# EAGLE design mt15_c (EAGLE 6.6.0)

## Sheet 1 of 3
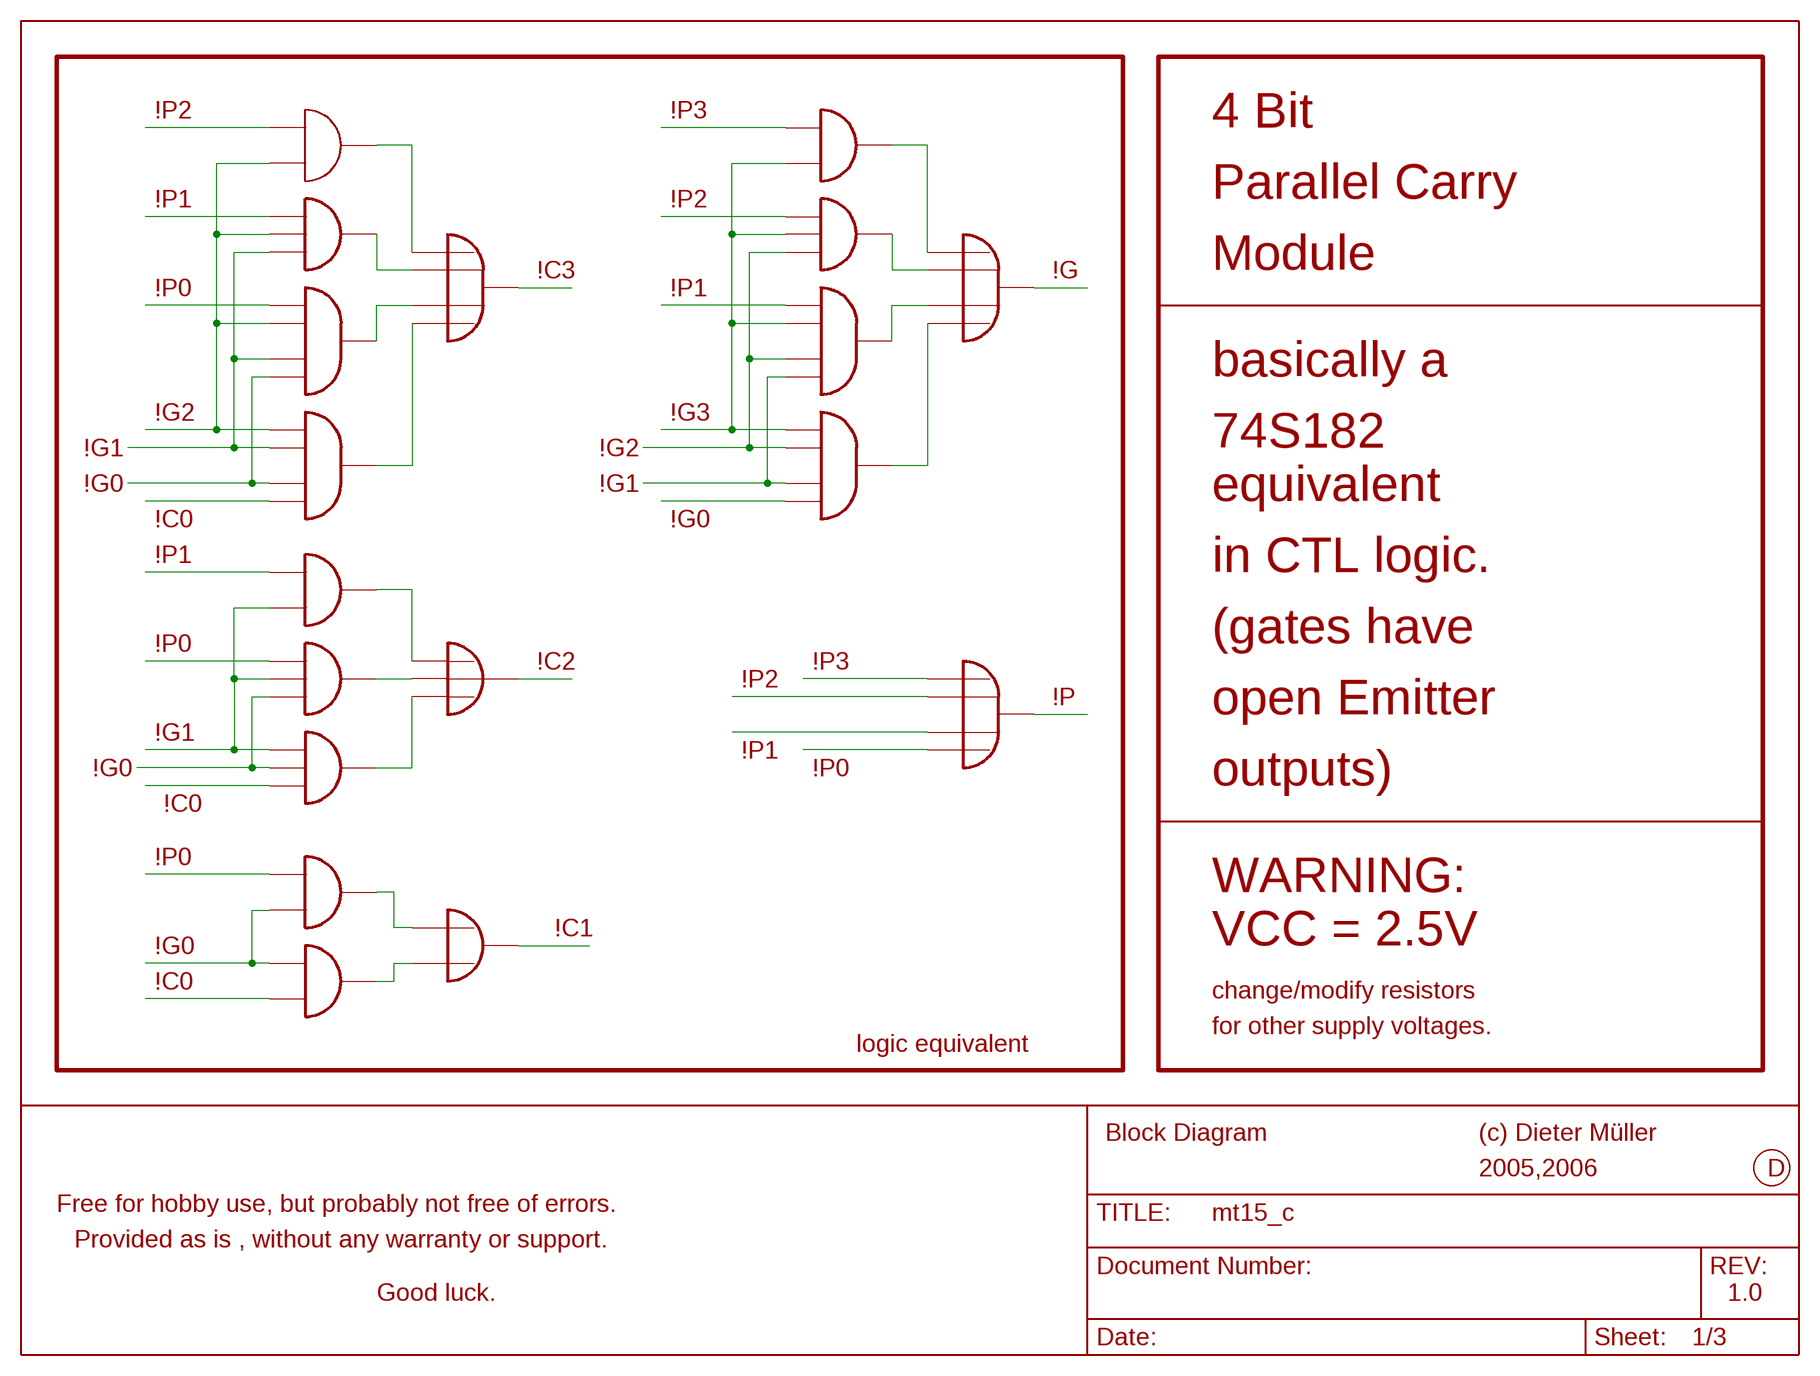
[diagram p0: schematic, sheet 1]

### Notes on the sheet
- \!P2 | \!P3
- 4 Bit
- Parallel Carry
- \!P1 | \!P2
- Module
- \!C3 | \!G
- \!P0 | \!P1
- basically a
- \!G2 | \!G3
- 74S182
- \!G1 | \!G2
- \!G0 | \!G1
- equivalent
- \!C0 | \!G0
- \!P1
- in CTL logic.
- (gates have
- \!P0
- \!C2 | \!P3
- \!P2
- \!P
- open Emitter
- \!G1
- \!P1
- \!G0 | \!P0
- outputs)
- \!C0
- \!P0
- WARNING:
- \!C1
- VCC = 2.5V
- \!G0
- \!C0
- change/modify resistors
- for other supply voltages.
- logic equivalent
- Block Diagram | (c) Dieter Müller
- 2005,2006 | D
- Free for hobby use, but probably not free of errors.
- Provided as is , without any warranty or support.
- Good luck. | 1.0
- Wenn dich jemand dann und wann,
- grundlos plötzlich lächelt an.
- Sag, was mag denn das wohl sein,
- vielleicht ein Kameradenschwein.
- Wenn sie Interesse heucheln,
- hinterrücks danach dich meucheln.
- 'Kannst du sowas nicht verzeihen',
- werden sie beleidigt schreien.
- Meine Meinung weise schlimm,
- auf Generalisierung hin.
- Nur nimmt dann, wenn ich nicht so tu',
- der Schmerz in meinem Rücken zu.
- Und trotz all der schlechten Zeit,
- bewundere ich Freundlichkeit.
- Nur ist in meinem Rücken schwer,
- kein Platz für weitere Messer mehr.
- Solltest du mich so verletzen,
- Freundlichkeit falsch einzusetzen,
- mögest du an allen Tagen,
- Meser in dem Rücken tragen.

## Sheet 2 of 3
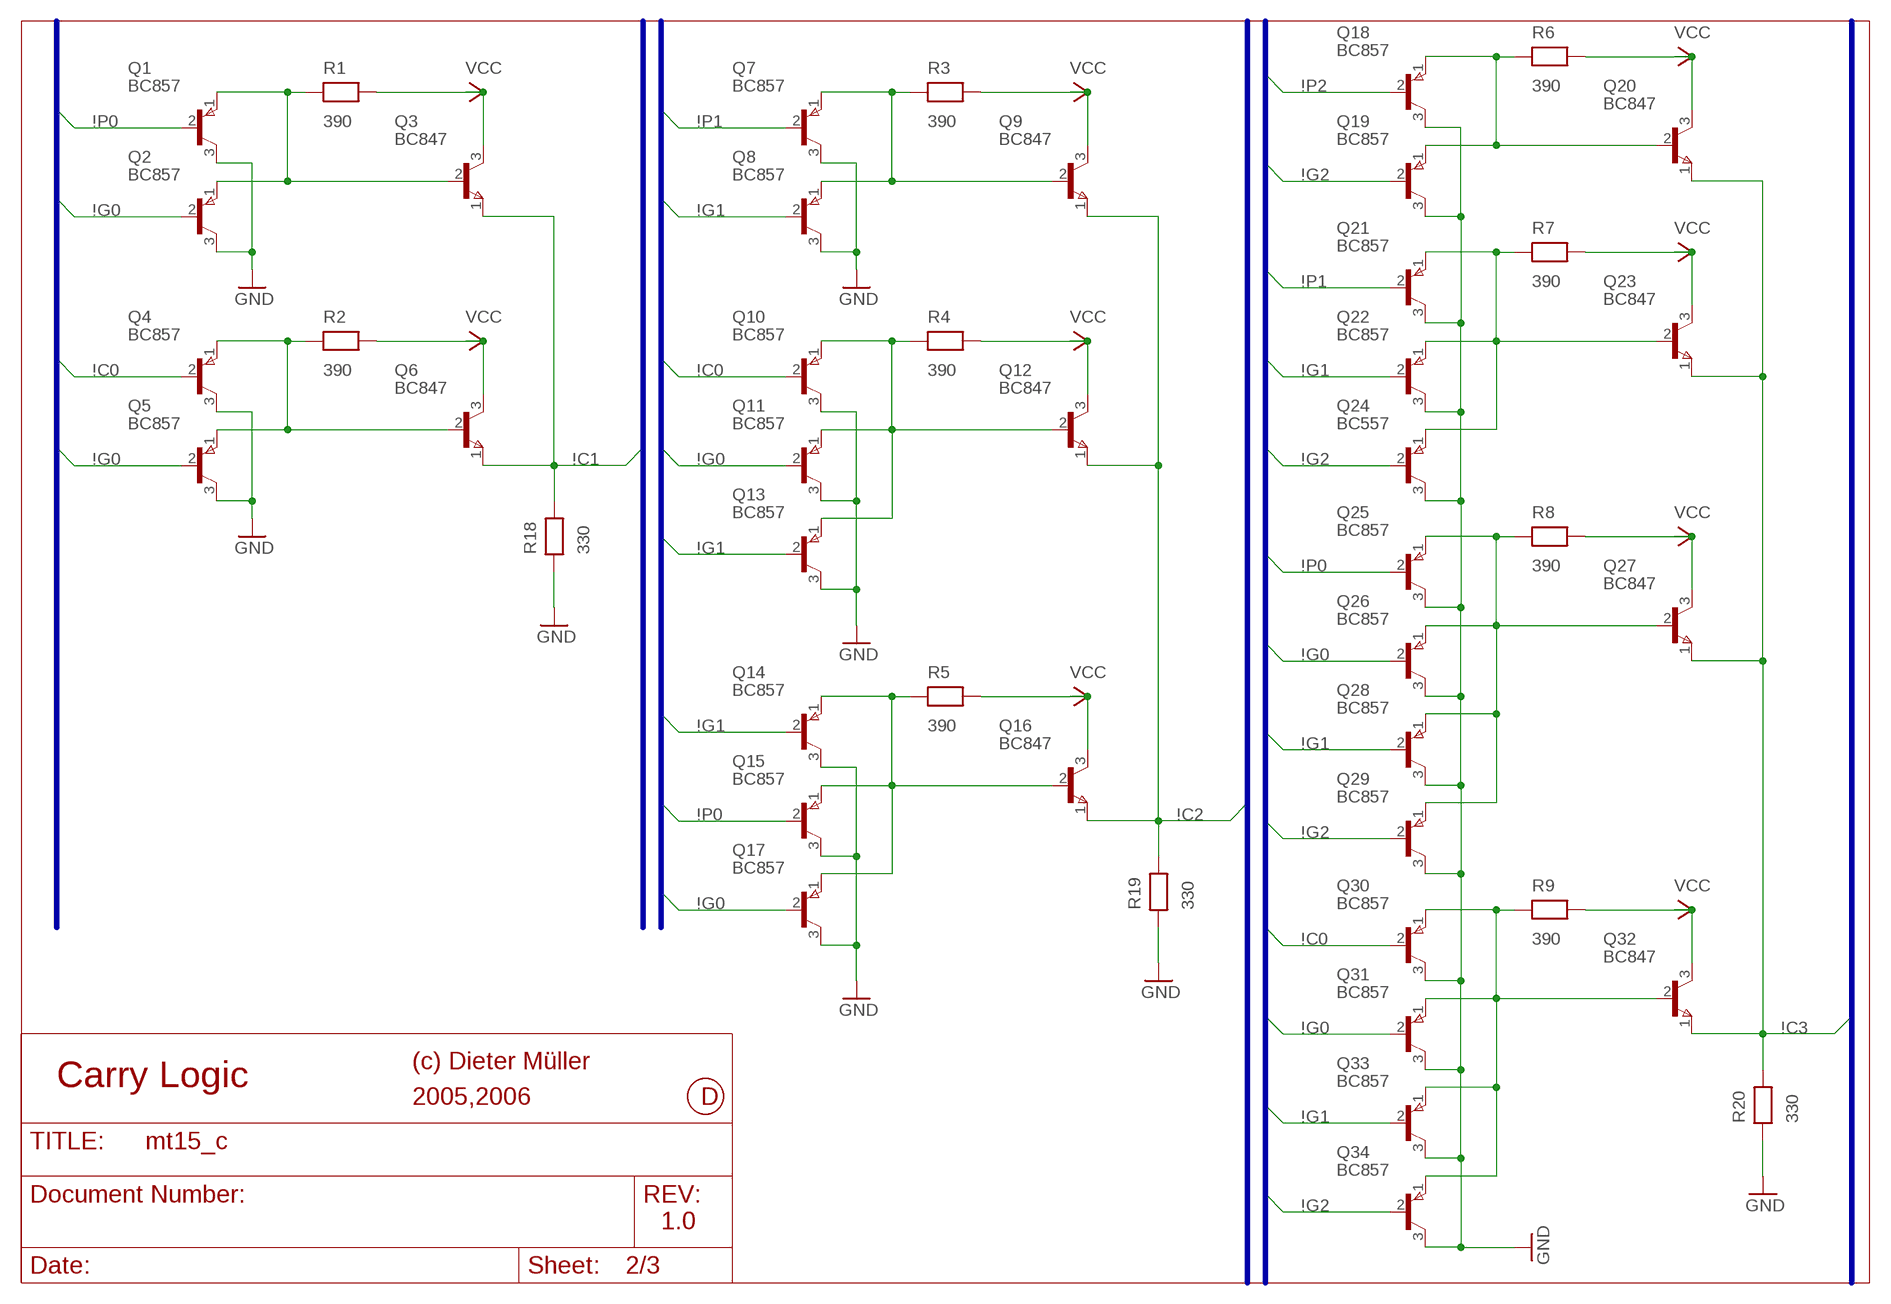
[diagram p1: schematic, sheet 2]

### Parts
Q1  BC857  BC557@2  [SOT-23]
Q2  BC857  BC557@2  [SOT-23]
Q3  BC847  BC547@2  [SOT-23]
Q4  BC857  BC557@2  [SOT-23]
Q5  BC857  BC557@2  [SOT-23]
Q6  BC847  BC547@2  [SOT-23]
Q7  BC857  BC557@2  [SOT-23]
Q8  BC857  BC557@2  [SOT-23]
Q9  BC847  BC547@2  [SOT-23]
Q10  BC857  BC557@2  [SOT-23]
Q11  BC857  BC557@2  [SOT-23]
Q12  BC847  BC547@2  [SOT-23]
Q13  BC857  BC557@2  [SOT-23]
Q14  BC857  BC557@2  [SOT-23]
Q15  BC857  BC557@2  [SOT-23]
Q16  BC847  BC547@2  [SOT-23]
Q17  BC857  BC557@2  [SOT-23]
Q18  BC857  BC557@2  [SOT-23]
Q19  BC857  BC557@2  [SOT-23]
Q20  BC847  BC547@2  [SOT-23]
Q21  BC857  BC557@2  [SOT-23]
Q22  BC857  BC557@2  [SOT-23]
Q23  BC847  BC547@2  [SOT-23]
Q24  BC557  BC557@2  [SOT-23]
Q25  BC857  BC557@2  [SOT-23]
Q26  BC857  BC557@2  [SOT-23]
Q27  BC847  BC547@2  [SOT-23]
Q28  BC857  BC557@2  [SOT-23]
Q29  BC857  BC557@2  [SOT-23]
Q30  BC857  BC557@2  [SOT-23]
Q31  BC857  BC557@2  [SOT-23]
Q32  BC847  BC547@2  [SOT-23]
Q33  BC857  BC557@2  [SOT-23]
Q34  BC857  BC557@2  [SOT-23]
R1  390  RESEU-7,5@2  [0204]
R2  390  RESEU-7,5@2  [0204]
R3  390  RESEU-7,5@2  [0204]
R4  390  RESEU-7,5@2  [0204]
R5  390  RESEU-7,5@2  [0204]
R6  390  RESEU-7,5@2  [0204]
R7  390  RESEU-7,5@2  [0204]
R8  390  RESEU-7,5@2  [0204]
R9  390  RESEU-7,5@2  [0204]
R18  330  RESEU-7,5@2  [0204]
R19  330  RESEU-7,5@2  [0204]
R20  330  RESEU-7,5@2  [0204]

### Nets
\!C0: Q4.2(B) Q10.2(B) Q30.2(B)
\!C1: Q3.1(E) Q6.1(E) R18.2
\!C2: Q9.1(E) Q12.1(E) Q16.1(E) R19.2
\!C3: Q20.1(E) Q23.1(E) Q27.1(E) Q32.1(E) R20.2
\!G0: Q2.2(B) Q5.2(B) Q11.2(B) Q17.2(B) Q26.2(B) Q31.2(B) ; also sheet 3
\!G1: Q8.2(B) Q13.2(B) Q14.2(B) Q22.2(B) Q28.2(B) Q33.2(B) ; also sheet 3
\!G2: Q19.2(B) Q24.2(B) Q29.2(B) Q34.2(B) ; also sheet 3
\!P0: Q1.2(B) Q15.2(B) Q25.2(B) ; also sheet 3
\!P1: Q7.2(B) Q21.2(B) ; also sheet 3
\!P2: Q18.2(B) ; also sheet 3
GND: Q1.3(C) Q2.3(C) Q4.3(C) Q5.3(C) Q7.3(C) Q8.3(C) Q10.3(C) Q11.3(C) Q13.3(C) Q14.3(C) Q15.3(C) Q17.3(C) Q18.3(C) Q19.3(C) Q21.3(C) Q22.3(C) Q24.3(C) Q25.3(C) Q26.3(C) Q28.3(C) Q29.3(C) Q30.3(C) Q31.3(C) Q33.3(C) Q34.3(C) R18.1 R19.1 R20.1 ; also sheet 3
N$9: Q1.1(E) Q2.1(E) Q3.2(B) R1.1
N$10: Q7.1(E) Q8.1(E) Q9.2(B) R3.1
N$11: Q4.1(E) Q5.1(E) Q6.2(B) R2.1
N$12: Q10.1(E) Q11.1(E) Q12.2(B) Q13.1(E) R4.1
N$13: Q14.1(E) Q15.1(E) Q16.2(B) Q17.1(E) R5.1
N$14: Q18.1(E) Q19.1(E) Q20.2(B) R6.1
N$15: Q21.1(E) Q22.1(E) Q23.2(B) Q24.1(E) R7.1
N$16: Q25.1(E) Q26.1(E) Q27.2(B) Q28.1(E) Q29.1(E) R8.1
N$17: Q30.1(E) Q31.1(E) Q32.2(B) Q33.1(E) Q34.1(E) R9.1
VCC: Q3.3(C) Q6.3(C) Q9.3(C) Q12.3(C) Q16.3(C) Q20.3(C) Q23.3(C) Q27.3(C) Q32.3(C) R1.2 R2.2 R3.2 R4.2 R5.2 R6.2 R7.2 R8.2 R9.2 ; also sheet 3

### Buses
B$1
B$2
B$3
B$4
B$5
B$6

### Notes on the sheet
- (c) Dieter Müller
- Carry Logic
- 2005,2006 | D
- 1.0

## Sheet 3 of 3
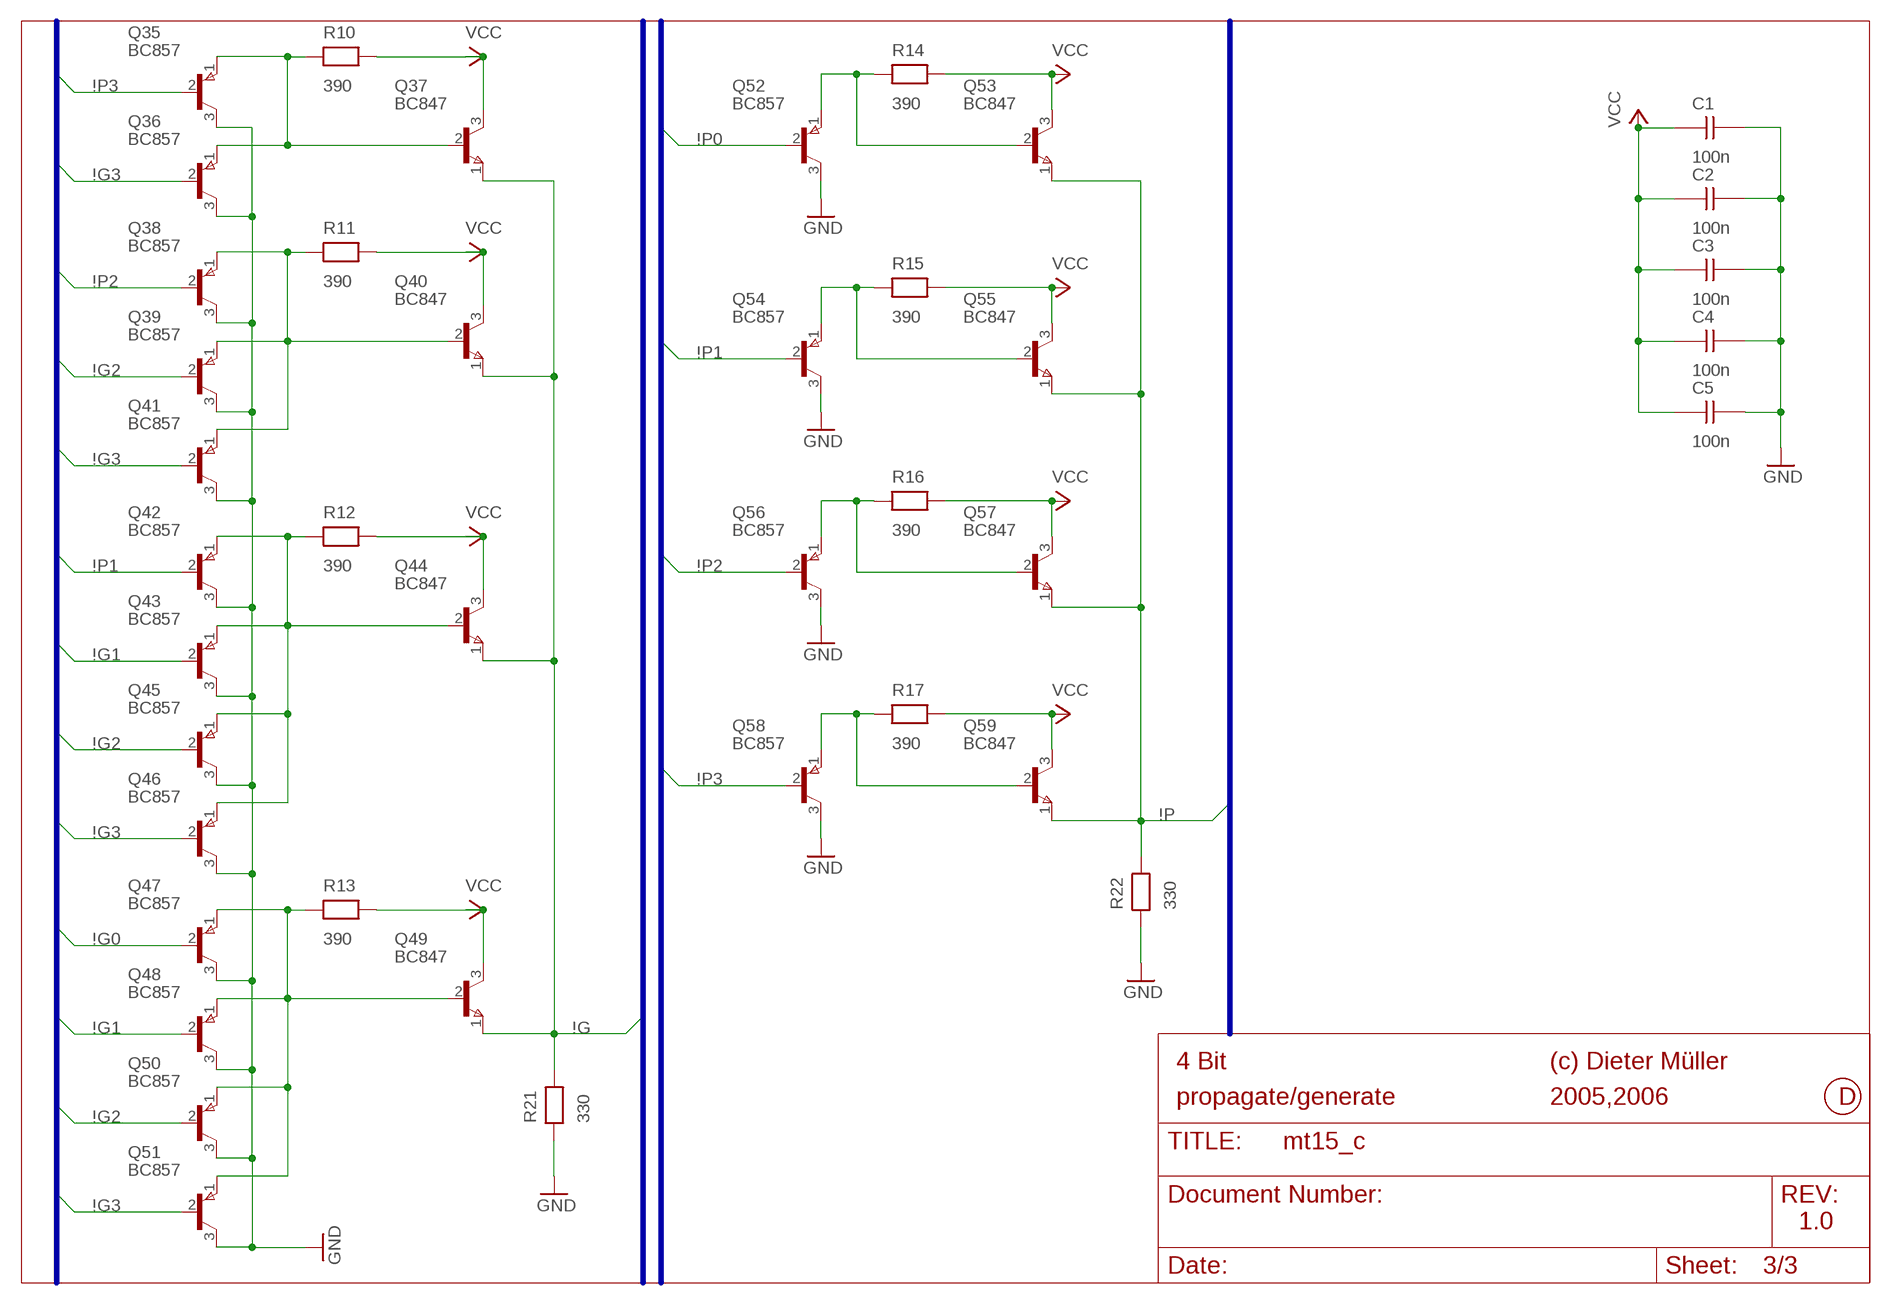
[diagram p2: schematic, sheet 3]

### Parts
C1  100n  CAPNP-5@2  [0204]
C2  100n  CAPNP-5@2  [0204]
C3  100n  CAPNP-5@2  [0204]
C4  100n  CAPNP-5@2  [0204]
C5  100n  CAPNP-5@2  [0204]
Q35  BC857  BC557@2  [SOT-23]
Q36  BC857  BC557@2  [SOT-23]
Q37  BC847  BC547@2  [SOT-23]
Q38  BC857  BC557@2  [SOT-23]
Q39  BC857  BC557@2  [SOT-23]
Q40  BC847  BC547@2  [SOT-23]
Q41  BC857  BC557@2  [SOT-23]
Q42  BC857  BC557@2  [SOT-23]
Q43  BC857  BC557@2  [SOT-23]
Q44  BC847  BC547@2  [SOT-23]
Q45  BC857  BC557@2  [SOT-23]
Q46  BC857  BC557@2  [SOT-23]
Q47  BC857  BC557@2  [SOT-23]
Q48  BC857  BC557@2  [SOT-23]
Q49  BC847  BC547@2  [SOT-23]
Q50  BC857  BC557@2  [SOT-23]
Q51  BC857  BC557@2  [SOT-23]
Q52  BC857  BC557@2  [SOT-23]
Q53  BC847  BC547@2  [SOT-23]
Q54  BC857  BC557@2  [SOT-23]
Q55  BC847  BC547@2  [SOT-23]
Q56  BC857  BC557@2  [SOT-23]
Q57  BC847  BC547@2  [SOT-23]
Q58  BC857  BC557@2  [SOT-23]
Q59  BC847  BC547@2  [SOT-23]
R10  390  RESEU-7,5@2  [0204]
R11  390  RESEU-7,5@2  [0204]
R12  390  RESEU-7,5@2  [0204]
R13  390  RESEU-7,5@2  [0204]
R14  390  RESEU-7,5@2  [0204]
R15  390  RESEU-7,5@2  [0204]
R16  390  RESEU-7,5@2  [0204]
R17  390  RESEU-7,5@2  [0204]
R21  330  RESEU-7,5@2  [0204]
R22  330  RESEU-7,5@2  [0204]

### Nets
\!G: Q37.1(E) Q40.1(E) Q44.1(E) Q49.1(E) R21.2
\!G0: Q47.2(B) ; also sheet 2
\!G1: Q43.2(B) Q48.2(B) ; also sheet 2
\!G2: Q39.2(B) Q45.2(B) Q50.2(B) ; also sheet 2
\!G3: Q36.2(B) Q41.2(B) Q46.2(B) Q51.2(B)
\!P: Q53.1(E) Q55.1(E) Q57.1(E) Q59.1(E) R22.2
\!P0: Q52.2(B) ; also sheet 2
\!P1: Q42.2(B) Q54.2(B) ; also sheet 2
\!P2: Q38.2(B) Q56.2(B) ; also sheet 2
\!P3: Q35.2(B) Q58.2(B)
GND: C1.2 C2.2 C3.2 C4.2 C5.2 Q35.3(C) Q36.3(C) Q38.3(C) Q39.3(C) Q41.3(C) Q42.3(C) Q43.3(C) Q45.3(C) Q46.3(C) Q47.3(C) Q48.3(C) Q50.3(C) Q51.3(C) Q52.3(C) Q54.3(C) Q56.3(C) Q58.3(C) R21.1 R22.1 ; also sheet 2
N$18: Q35.1(E) Q36.1(E) Q37.2(B) R10.1
N$19: Q38.1(E) Q39.1(E) Q40.2(B) Q41.1(E) R11.1
N$20: Q42.1(E) Q43.1(E) Q44.2(B) Q45.1(E) Q46.1(E) R12.1
N$21: Q47.1(E) Q48.1(E) Q49.2(B) Q50.1(E) Q51.1(E) R13.1
N$22: Q52.1(E) Q53.2(B) R14.1
N$24: Q54.1(E) Q55.2(B) R15.1
N$25: Q56.1(E) Q57.2(B) R16.1
N$26: Q58.1(E) Q59.2(B) R17.1
VCC: C1.1 C2.1 C3.1 C4.1 C5.1 Q37.3(C) Q40.3(C) Q44.3(C) Q49.3(C) Q53.3(C) Q55.3(C) Q57.3(C) Q59.3(C) R10.2 R11.2 R12.2 R13.2 R14.2 R15.2 R16.2 R17.2 ; also sheet 2

### Buses
B$5
B$6
B$9
B$10

### Notes on the sheet
- 4 Bit | (c) Dieter Müller
- propagate/generate | 2005,2006 | D
- 1.0

## Library data of the parts
C1-C5 = DISCRETE:CAPNP-5@2
Q1 Q2 Q4 Q5 Q7 Q8 Q10 Q11 Q13-Q15 Q17-Q19 Q21 Q22 Q24-Q26 Q28-Q31 Q33-Q36 Q38 Q39 Q41-Q43 Q45-Q48 Q50-Q52 Q54 Q56 Q58 = PNP:BC557@2
Q3 Q6 Q9 Q12 Q16 Q20 Q23 Q27 Q32 Q37 Q40 Q44 Q49 Q53 Q55 Q57 Q59 = NPN:BC547@2
R1-R22 = DISCRETE:RESEU-7,5@2

## Board
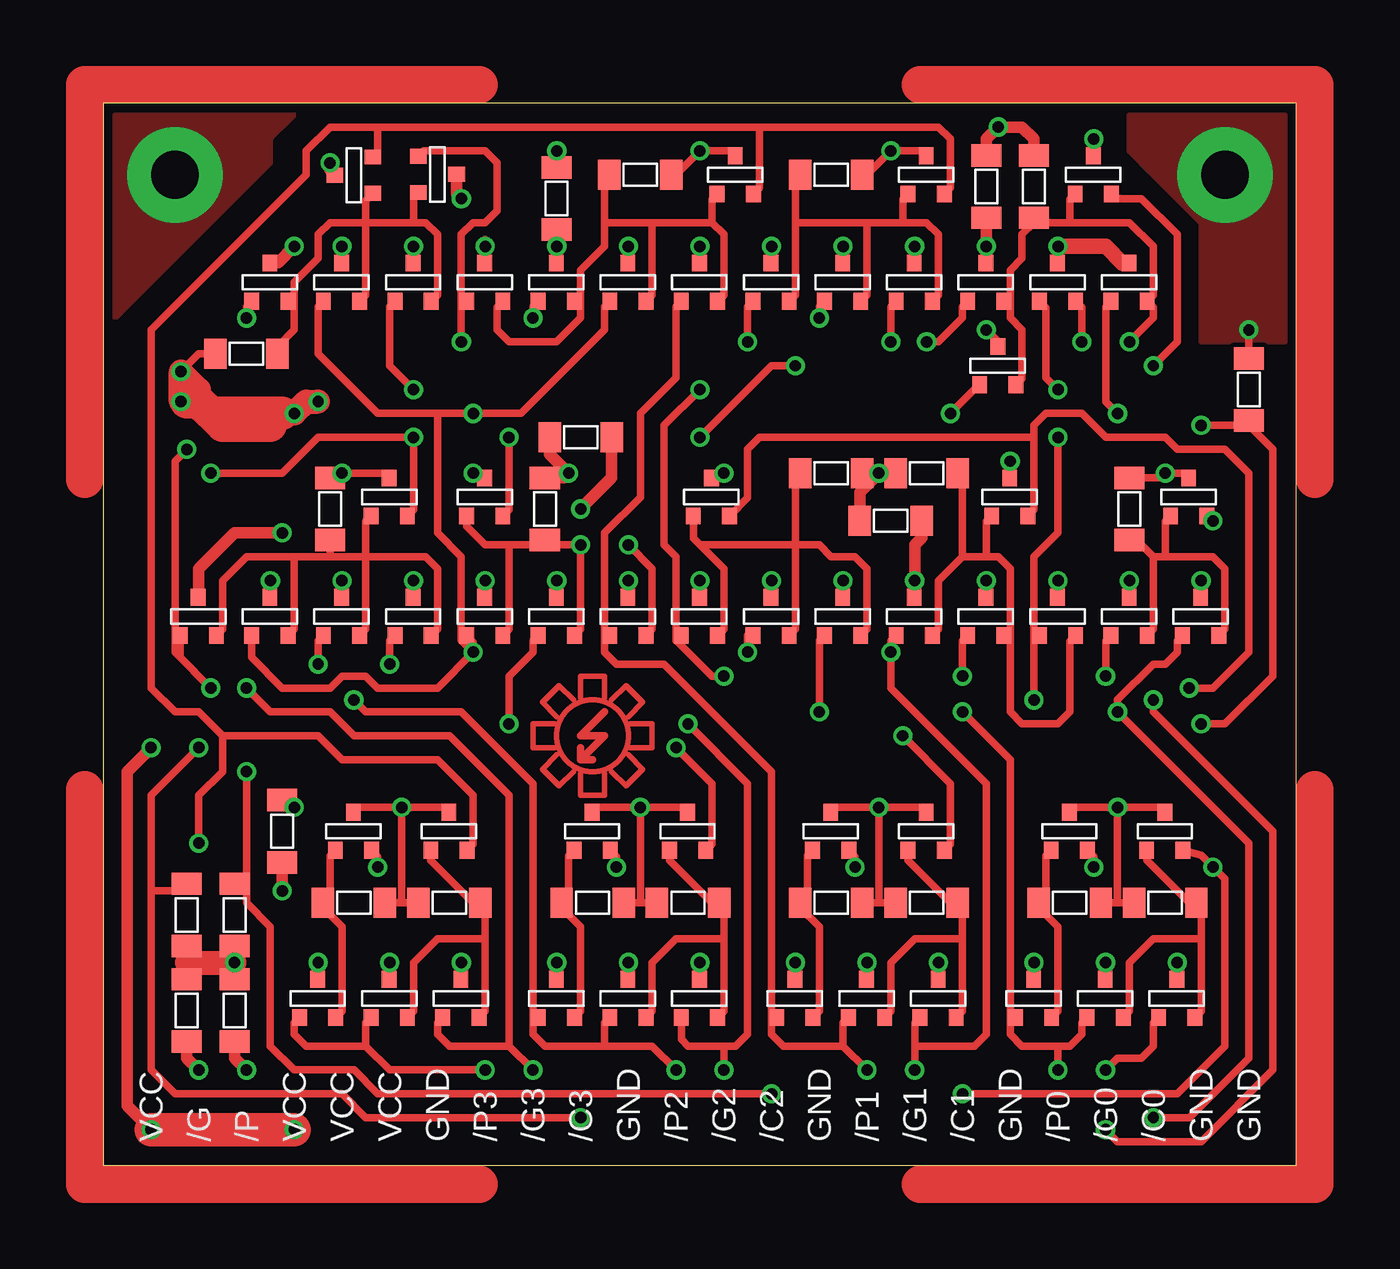
[diagram p3: board, top side]
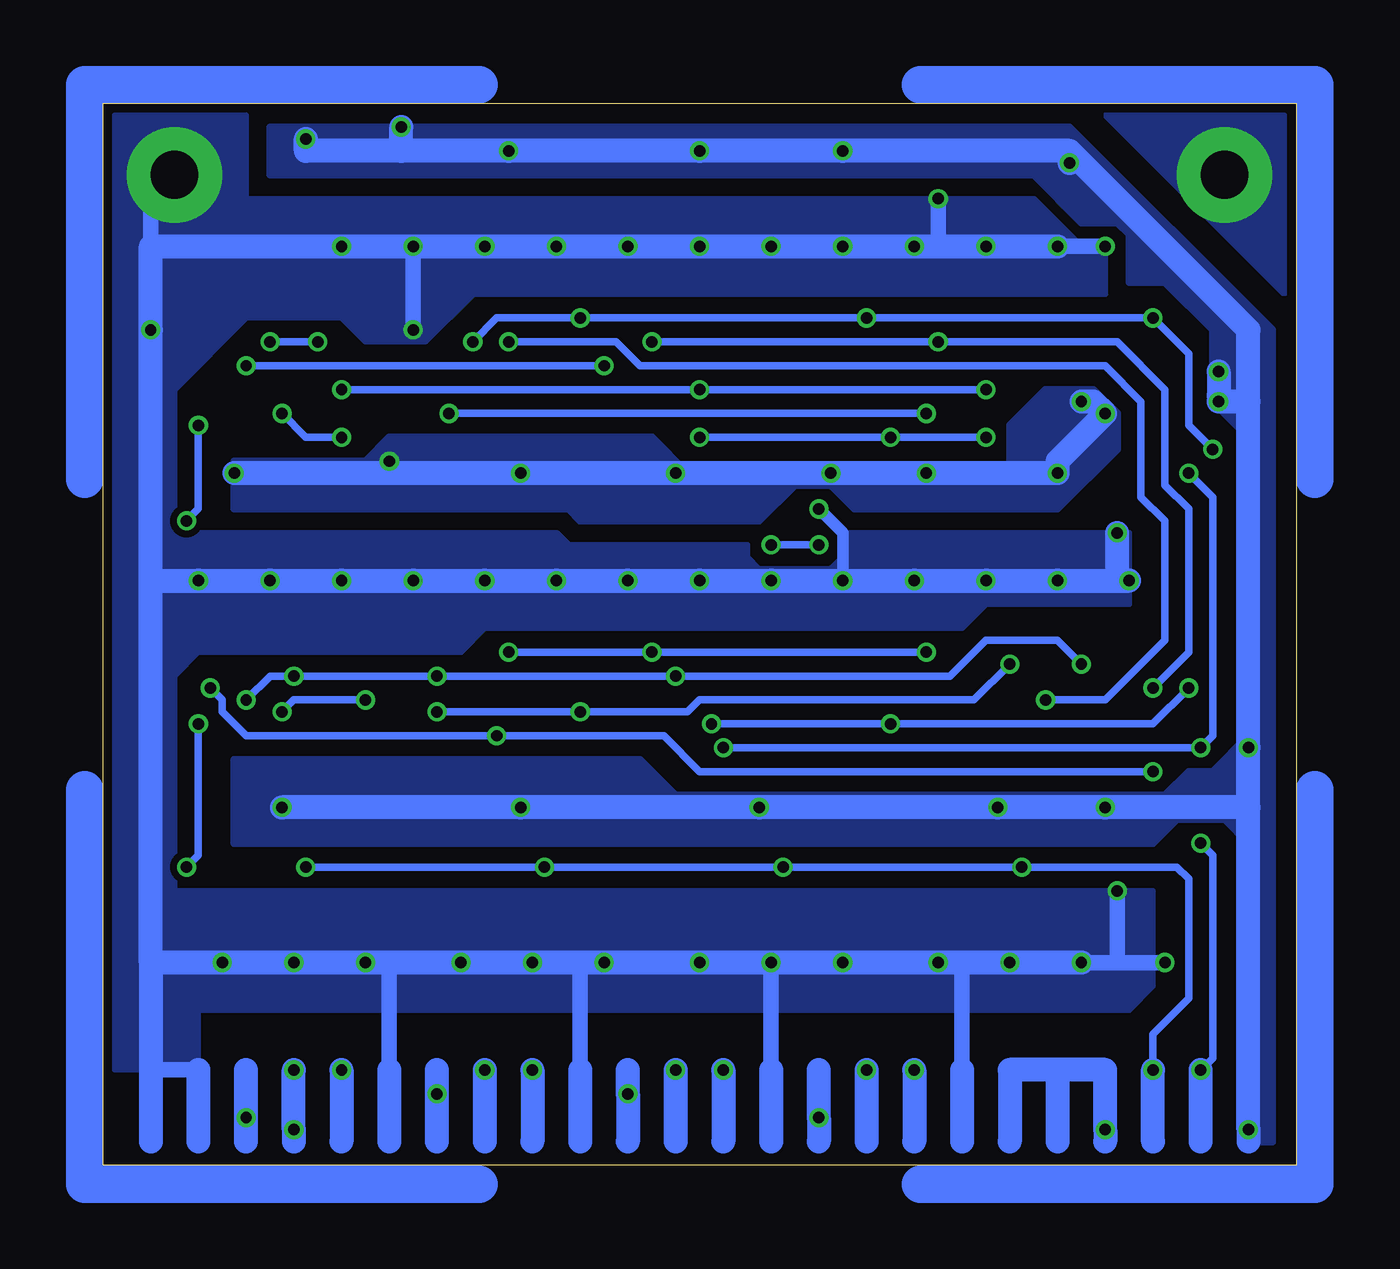
[diagram p4: board, bottom side, seen from below]

Size 63.48 x 56.5 mm. Coordinates in mm from the lower left corner, seen from the top.
Outline: 0,0 63.48,0 63.48,56.5 0,56.5 0,0
Copper layers (1*16): Top 0.035mm / dielectric 1.5mm / Bottom 0.035mm
Design rules "default": minimum track width 10mil, minimum drill 0.6mm, track to track 8mil, track to pad 8mil, pad to pad 8mil, via to via 8mil, smd to smd 8mil, copper to edge 0mil, drill to drill 8mil, minimum pad ring 10mil, minimum via ring 8mil, stop-mask expansion 4mil, vias tented up to drill 0mil, thermal gap 10mil

### Footprints (pad centres in the part's own frame; a part is rotated, then mirrored left to right if it is on the bottom)
0204 = smd 1.194 x 1.6: 1 -1.651,0; 2 1.651,0
SOT-23 = smd 0.787 x 0.889: 1 -0.94,1.016; 2 0.991,1.016; 3 0.025,-1.016

### Placement (x,y rotation side)
C1  24.13,51.44 270 top
C2  46.99,52.07 270 top
C3  25.4,38.73 0 top
C4  41.91,34.29 0 top
C5  9.53,17.78 270 top
Q1  53.34,8.89 180 top
Q2  57.15,8.89 180 top
Q3  56.52,17.78 180 top
Q4  58.42,29.21 180 top
Q5  54.61,29.21 180 top
Q6  57.78,35.56 180 top
Q7  40.64,8.89 180 top
Q8  44.45,8.89 180 top
Q9  43.81,17.78 180 top
Q10  50.8,29.21 180 top
Q11  46.99,29.21 180 top
Q12  48.26,35.56 180 top
Q13  43.18,29.21 180 top
Q14  35.56,29.21 180 top
Q15  39.37,29.21 180 top
Q16  32.38,35.56 180 top
Q17  31.75,29.21 180 top
Q18  27.94,8.89 180 top
Q19  31.75,8.89 180 top
Q20  31.11,17.78 180 top
Q21  27.94,29.21 180 top
Q22  20.32,29.21 180 top
Q23  20.32,35.56 180 top
Q24  24.13,29.21 180 top
Q25  16.51,29.21 180 top
Q26  12.7,29.21 180 top
Q27  15.24,35.56 180 top
Q28  8.89,29.21 180 top
Q29  5.08,29.21 180 top
Q30  54.61,46.99 180 top
Q31  50.8,46.99 180 top
Q32  52.7,52.7 180 top
Q33  47.62,42.55 180 top
Q34  46.99,46.99 180 top
Q35  15.24,8.89 180 top
Q36  19.05,8.89 180 top
Q37  18.41,17.78 180 top
Q38  43.18,46.99 180 top
Q39  39.37,46.99 180 top
Q40  43.81,52.7 180 top
Q41  35.56,46.99 180 top
Q42  31.75,46.99 180 top
Q43  27.94,46.99 180 top
Q44  33.66,52.7 180 top
Q45  24.13,46.99 180 top
Q46  20.32,46.99 180 top
Q47  16.51,46.99 180 top
Q48  12.7,46.99 180 top
Q49  13.34,52.7 270 top
Q50  8.89,46.99 180 top
Q51  17.78,52.7 90 top
Q52  49.53,8.89 180 top
Q53  51.44,17.78 180 top
Q54  36.83,8.89 180 top
Q55  38.73,17.78 180 top
Q56  24.13,8.89 180 top
Q57  26.04,17.78 180 top
Q58  11.43,8.89 180 top
Q59  13.34,17.78 180 top
R1  56.52,13.97 180 top
R2  54.61,34.92 90 top
R3  43.81,13.97 180 top
R4  43.81,36.83 180 top
R5  38.73,36.83 0 top
R6  31.11,13.97 180 top
R7  23.5,34.92 90 top
R8  12.06,34.92 90 top
R9  49.53,52.07 90 top
R10  18.41,13.97 180 top
R11  38.73,52.7 0 top
R12  28.57,52.7 0 top
R13  7.62,43.18 180 top
R14  51.44,13.97 0 top
R15  38.73,13.97 0 top
R16  26.04,13.97 0 top
R17  13.34,13.97 0 top
R18  60.96,41.27 270 top
R19  6.99,13.34 90 top
R20  4.45,13.34 90 top
R21  4.45,8.26 270 top
R22  6.99,8.26 270 top
U$46  [T1]  26.04,22.86 0 top

### Tracks (layer width: path | path; a pad name or v marks a point on that pad's centre or on a via)
\!C0  (via drill 0.61 pad 1.02)
  Top 0.406: v55.88,2.54 57.78,2.54 60.96,5.71 60.96,17.14 v53.98,24.13 53.98,24.77 55.88,26.67 56.52,26.67 57.15,27.3 57.15,27.91 Q4.2 | Q10.2 49.53,27.91 49.53,27.3 | v49.53,24.77 49.53,27.3 | 49.53,27.3 49.53,32.38 50.8,33.66 v50.8,38.73 | Q30.2 53.34,45.7 53.34,40.64 v53.98,40.01
  Bottom 0.406: v53.98,24.13 53.34,24.77 v49.53,24.77 | v53.98,40.01 52.7,38.73 v50.8,38.73
  Bottom 1.27: 55.88,1.27 v55.88,2.54 55.88,5.08
\!C1  (via drill 0.61 pad 1.02)
  Top 0.406: v45.72,3.81 57.15,3.81 59.69,6.35 59.69,15.24 v59.05,15.88 58.8,16.13 58.42,16.51 Q3.1 | v58.42,23.5 59.69,23.5 62.23,26.04 62.23,38.1 60.96,39.37 | 60.96,39.37 v58.42,39.37 | Q6.1 58.8,34.54 v59.05,34.29 | 60.96,39.37 R18.2
  Bottom 0.406: v59.05,15.88 58.42,16.51 v58.42,23.5 | v59.05,34.29 58.42,34.92 v58.42,39.37
  Bottom 1.27: 45.72,1.27 v45.72,3.81 45.72,5.08
\!C2  (via drill 0.61 pad 1.02)
  Top 0.406: v35.56,3.81 14.61,3.81 13.34,5.08 10.16,5.08 8.89,6.35 8.89,12.7 7.62,13.97 7.62,14.61 | R19.2 7.37,14.61 7.62,14.61 | 7.62,14.61 v7.62,20.95 | Q9.1 45.09,17.09 45.09,20.32 v42.55,22.86 | v57.78,25.4 59.05,25.4 60.96,27.3 60.96,36.83 59.69,38.1 57.15,38.1 56.52,38.73 53.34,38.73 52.07,40.01 50.16,40.01 49.53,39.37 49.53,38.73 | Q12.1 49.53,34.87 49.53,38.73 | Q16.1 34.29,35.51 34.29,38.1 34.92,38.73 49.53,38.73
  Bottom 0.406: v7.62,20.95 31.75,20.95 33.66,22.86 v42.55,22.86 55.88,22.86 57.15,24.13 57.15,24.77 v57.78,25.4
  Bottom 1.27: 35.56,1.27 v35.56,3.81 35.56,5.08
\!C3  (via drill 0.61 pad 1.02)
  Top 0.406: v25.4,2.54 13.97,2.54 12.7,3.81 3.81,3.81 2.54,5.08 2.54,14.61 | 2.54,14.61 2.54,19.68 v5.08,22.23 | R20.2 4.06,14.61 2.54,14.61 | Q20.1 32.38,17.09 32.38,20.32 v30.48,22.23 | Q27.1 16.51,34.87 v16.51,38.73 11.43,38.73 9.53,36.83 v5.71,36.83 | Q23.1 21.59,34.87 v21.59,38.73 | v31.75,38.73 35.56,42.55 v36.83,42.55 | v55.88,42.55 57.15,43.81 57.15,49.53 55.24,51.44 53.9,51.44 Q32.1
  Bottom 0.406: v30.48,22.23 v5.08,22.23 4.45,22.86 4.45,35.56 v5.71,36.83 | v16.51,38.73 v21.59,38.73 v31.75,38.73 | v36.83,42.55 v55.88,42.55
  Bottom 1.27: 25.4,1.27 v25.4,2.54 25.4,5.08
\!G  (via drill 0.61 pad 1.02)
  Top 0.406: Q37.1 19.68,17.09 19.68,19.68 17.78,21.59 12.7,21.59 11.43,22.86 6.35,22.86 | 6.35,22.86 6.35,20.95 5.08,19.68 v5.08,17.14 | 6.35,22.86 5.08,24.13 3.81,24.13 2.54,25.4 2.54,44.45 10.79,52.7 10.79,53.98 12.06,55.24 14.61,55.24 | 14.61,55.24 34.92,55.24 | Q44.1 34.92,52.02 34.92,55.24 | Q40.1 45.09,52.02 45.09,54.61 44.45,55.24 34.92,55.24 | Q49.1 14.61,53.9 14.61,55.24
  Top 0.61: v5.08,5.08 4.45,5.71 R21.2
  Bottom 0.406: v5.08,5.08 4.45,5.71 4.45,16.51 v5.08,17.14
  Bottom 1.27: 5.08,1.27 v5.08,5.08
\!G0  (via drill 0.61 pad 1.02)
  Top 0.406: v53.34,5.08 53.98,5.71 55.24,5.71 55.88,6.35 55.88,7.59 Q2.2 | v53.34,1.91 53.98,1.27 58.42,1.27 62.23,5.08 62.23,17.78 55.88,24.13 v55.88,24.77 | Q5.2 53.34,27.91 v53.34,26.04 | Q26.2 11.43,27.91 v11.43,26.67 | Q17.2 30.48,27.91 30.48,27.94 | Q11.2 45.72,27.91 v45.72,26.04 | v33.02,26.04 32.38,26.04 30.48,27.94 | 30.48,27.94 30.48,32.38 29.84,33.02 29.84,39.37 v31.75,41.27 | Q47.2 15.24,45.7 15.24,42.55 v16.51,41.27 | Q31.2 50.16,45.62 50.16,41.91 v50.8,41.27
  Bottom 0.406: v55.88,24.77 54.61,26.04 v53.34,26.04 v45.72,26.04 v33.02,26.04 18.41,26.04 16.51,27.94 12.7,27.94 v11.43,26.67 | v50.8,41.27 v31.75,41.27 v16.51,41.27
  Bottom 1.27: 53.34,1.27 v53.34,1.91 v53.34,5.08
\!G1  (via drill 0.61 pad 1.02)
  Top 0.406: Q8.2 43.18,7.59 43.18,6.35 | 43.18,6.35 v43.18,5.08 | 43.18,6.35 46.35,6.35 46.99,6.99 46.99,20.32 41.91,25.4 v41.91,27.3 41.91,27.91 Q13.2 | Q28.2 7.9,27.03 9.53,25.4 12.06,25.4 12.7,26.04 13.97,26.04 14.61,25.4 17.78,25.4 v19.68,27.3 | Q22.2 19.68,27.84 v19.68,27.3 | v19.68,27.3 19.05,27.94 19.05,32.38 17.78,33.66 17.78,40.01 | Q48.2 11.43,45.7 11.43,43.18 14.61,40.01 17.78,40.01 | 17.78,40.01 v19.68,40.01 22.23,40.01 26.67,44.45 26.67,45.7 Q43.2 | Q14.2 34.29,28.19 v34.29,27.3 | Q33.2 46.61,41.53 v45.09,40.01
  Bottom 0.406: v19.68,27.3 v34.29,27.3 v41.91,27.3 | v19.68,40.01 v45.09,40.01
  Bottom 1.27: v43.18,5.08 43.18,1.27
\!G2  (via drill 0.61 pad 1.02)
  Top 0.406: Q19.2 30.76,6.71 31.11,6.35 33.02,6.35 | 33.02,6.35 33.66,6.35 34.29,6.99 34.29,20.32 v31.11,23.5 | 33.02,6.35 v33.02,5.08 | Q24.2 22.86,27.91 22.86,27.3 21.59,26.04 v21.59,23.5 | Q29.2 4.09,27.03 v5.71,25.4 3.81,27.3 3.81,37.47 v4.45,38.1 | Q50.2 7.62,45.7 v7.62,45.09 | Q45.2 22.86,45.7 v22.86,45.09 | Q39.2 38.1,45.7 v38.1,45.09 | Q34.2 45.72,45.7 45.72,45.09 44.45,43.81 v43.81,43.81
  Bottom 0.406: v31.11,23.5 v21.59,23.5 7.62,23.5 v5.71,25.4 | v43.81,43.81 42.55,45.09 v38.1,45.09 v22.86,45.09 v7.62,45.09 5.71,43.18 5.71,39.37 v4.45,38.1
  Bottom 1.27: v33.02,5.08 33.02,1.27
\!G3  (via drill 0.61 pad 1.02)
  Top 0.406: Q36.2 17.78,7.59 17.78,6.99 18.41,6.35 21.59,6.35 | 21.59,6.35 v22.86,5.08 | 21.59,6.35 21.59,19.68 18.41,22.86 13.34,22.86 12.06,24.13 8.89,24.13 v7.62,25.4 | Q41.2 34.29,45.7 v34.29,43.81 | Q46.2 19.05,45.7 19.05,45.09 | v19.05,43.81 19.05,45.09 | 19.05,45.09 19.05,49.53 19.68,50.16 20.32,50.16 20.95,50.8 20.95,53.34 20.32,53.98 17.04,53.98 Q51.2
  Bottom 0.406: v7.62,25.4 5.71,27.3 5.71,34.92 6.99,36.2 6.99,41.27 9.53,43.81 v19.05,43.81 v34.29,43.81
  Bottom 1.27: v22.86,5.08 22.86,1.27
\!P  (via drill 0.61 pad 1.02)
  Top 0.406: Q59.1 14.61,16.43 v14.61,15.88 | Q57.1 27.3,16.43 v27.3,15.88 | Q55.1 40.01,16.43 v40.01,15.88 | Q53.1 52.7,16.43 v52.7,15.88
  Top 0.61: v7.62,5.08 6.99,5.71 R22.2
  Bottom 0.406: v7.62,5.08 7.62,6.99 5.71,8.89 5.71,15.24 6.35,15.88 v14.61,15.88 v27.3,15.88 v40.01,15.88 v52.7,15.88
  Bottom 1.27: 7.62,1.27 v7.62,5.08
\!P0  (via drill 0.61 pad 1.02)
  Top 0.406: Q52.2 48.26,7.59 48.26,6.99 | 48.26,6.99 48.9,6.35 50.8,6.35 | 50.8,6.35 51.44,6.35 52.07,6.99 52.07,7.59 Q1.2 | 50.8,6.35 v50.8,5.08 | v45.72,24.13 48.26,21.59 48.26,6.99 | Q15.2 38.1,27.91 v38.1,24.13 | Q25.2 15.24,27.91 v15.24,26.67
  Bottom 0.406: v45.72,24.13 v38.1,24.13 32.38,24.13 31.75,24.77 17.14,24.77 v15.24,26.67
  Bottom 1.27: v50.8,5.08 50.8,1.27
\!P1  (via drill 0.61 pad 1.02)
  Top 0.406: Q54.2 35.56,7.59 35.56,6.99 | 35.56,6.99 36.2,6.35 39.37,6.35 | Q7.2 39.37,7.59 39.37,6.35 | 39.37,6.35 v40.64,5.08 | Q21.2 26.67,27.91 26.67,27.3 | 26.67,27.3 27.3,26.67 29.84,26.67 35.56,20.95 35.56,6.99 | Q42.2 30.48,45.7 30.48,41.91 28.57,40.01 28.57,35.56 26.67,33.66 26.67,27.3
  Bottom 1.27: v40.64,5.08 40.64,1.27
\!P2  (via drill 0.61 pad 1.02)
  Top 0.406: Q56.2 22.86,7.59 22.86,6.99 | 22.86,6.99 23.5,6.35 26.67,6.35 | Q18.2 26.67,7.59 26.67,6.35 | v30.48,5.08 29.21,6.35 26.67,6.35 | 22.86,6.99 22.86,20.32 19.05,24.13 13.97,24.13 v13.34,24.77 | Q38.2 41.91,45.7 v41.91,43.81
  Bottom 0.406: v13.34,24.77 10.16,24.77 6.99,27.94 6.99,34.29 8.26,35.56 8.26,40.64 10.16,42.55 34.92,42.55 36.2,43.81 v41.91,43.81
  Bottom 1.27: v30.48,5.08 30.48,1.27
\!P3  (via drill 0.61 pad 1.02)
  Top 0.406: Q58.2 10.16,7.59 10.16,6.99 10.79,6.35 13.97,6.35 | Q35.2 13.97,7.59 13.97,6.35 | v20.32,5.08 15.24,5.08 13.97,6.35
  Bottom 1.27: v20.32,5.08 20.32,1.27
GND  (via drill 0.61 pad 1.02, 2.54 pad 5.08)
  Top 0.406: v60.96,44.45 R18.1 | Q33.3 47.6,43.84 v46.99,44.45
  Top 0.61: Q58.3 11.43,9.91 v11.43,10.79 | Q35.3 15.24,9.91 v15.24,10.79 | Q36.3 19.05,9.91 v19.05,10.79 | Q56.3 24.13,9.91 v24.13,10.79 | Q18.3 27.94,9.91 v27.94,10.79 | Q19.3 31.75,9.91 v31.75,10.79 | Q54.3 36.83,9.91 v36.83,10.79 | Q7.3 40.64,9.91 v40.64,10.79 | Q8.3 44.45,9.91 v44.45,10.79 | Q52.3 49.53,9.91 v49.53,10.79 | Q2.3 57.15,9.91 v57.15,10.79 | Q1.3 53.34,9.91 v53.34,10.79 | R21.1 4.45,10.79 R20.1 | R22.1 v6.99,10.79 R19.1 | Q29.3 5.08,30.25 5.08,31.75 6.99,33.66 v9.53,33.66 | Q28.3 8.89,30.25 v8.89,31.11 | Q26.3 12.7,30.25 v12.7,31.11 | Q25.3 16.51,30.25 v16.51,31.11 | Q22.3 20.32,30.25 v20.32,31.11 | Q24.3 24.13,30.25 v24.13,31.11 | Q21.3 27.94,30.25 v27.94,31.11 | Q17.3 31.75,30.25 v31.75,31.11 | Q14.3 35.56,30.25 v35.56,31.11 | Q15.3 39.37,30.25 v39.37,31.11 | Q13.3 43.18,30.25 v43.18,31.11 43.18,33.02 43.56,33.4 C4.2 | Q11.3 46.99,30.25 v46.99,31.11 | Q10.3 50.8,30.25 v50.8,31.11 | Q5.3 54.61,30.25 v54.61,31.11 | Q4.3 58.42,30.25 v58.42,31.11 | Q31.3 50.8,48.03 v50.8,48.9 | Q34.3 46.99,48.03 v46.99,48.9 C2.2 | Q38.3 43.18,48.03 v43.18,48.9 | Q39.3 39.37,48.03 v39.37,48.9 | Q41.3 35.56,48.03 v35.56,48.9 | Q42.3 31.75,48.03 v31.75,48.9 | Q50.3 8.89,48.03 9.3,48.03 v10.16,48.9 | Q48.3 12.7,48.03 v12.7,48.9 | Q47.3 16.51,48.03 v16.51,48.9 | Q46.3 20.32,48.03 v20.32,48.9 20.32,49.15 | Q45.3 24.13,48.03 v24.13,48.9 C1.2 | Q43.3 27.94,48.03 v27.94,48.9 | C3.2 27.05,36.58 v25.4,34.92 | v9.53,14.61 C5.2 | Q51.3 18.8,51.69 v19.05,51.44
  Top 0.813: Q30.3 54.23,48.01 53.34,48.9 v50.8,48.9
  Top 1.27: 4.45,10.79 v6.99,10.79
  Bottom 0.61: v25.4,34.92 24.13,33.66 v24.13,31.11
  Bottom 0.813: v6.99,10.79 9.53,10.79 | 9.53,10.79 v9.53,14.61 | 9.53,10.79 v11.43,10.79 | v12.7,48.9 v10.16,48.9 | 60.96,5.08 58.42,5.08 | 38.1,10.79 38.1,5.08 | 48.26,10.79 48.26,5.08 | v27.94,10.79 27.94,5.08 | 17.78,10.79 17.78,5.08 | v46.99,48.9 v46.99,44.45 | 60.96,48.9 60.96,51.44 v59.69,52.7 | 19.05,48.9 v19.05,51.44
  Bottom 1.27: v11.43,10.79 v15.24,10.79 17.78,10.79 v19.05,10.79 v24.13,10.79 v27.94,10.79 v31.75,10.79 v36.83,10.79 38.1,10.79 v40.64,10.79 v44.45,10.79 48.26,10.79 v49.53,10.79 v53.34,10.79 v57.15,10.79 60.96,10.79 | 60.96,10.79 60.96,31.11 | 60.96,31.11 v60.96,44.45 60.96,48.9 v50.8,48.9 v46.99,48.9 v43.18,48.9 v39.37,48.9 v35.56,48.9 v31.75,48.9 v27.94,48.9 v24.13,48.9 v20.32,48.9 19.05,48.9 v16.51,48.9 v12.7,48.9 | 9.53,31.11 v9.53,33.66 | 9.53,31.11 v12.7,31.11 v16.51,31.11 v20.32,31.11 v24.13,31.11 v27.94,31.11 v31.75,31.11 v35.56,31.11 v39.37,31.11 v43.18,31.11 v46.99,31.11 v50.8,31.11 v54.61,31.11 v58.42,31.11 60.96,31.11 | 9.53,31.11 v8.89,31.11 | 60.96,10.79 60.96,5.08 60.96,1.27 | 58.42,5.08 58.42,1.27 | 38.1,5.08 38.1,1.27 | 48.26,5.08 48.26,1.27 | 27.94,5.08 27.94,1.27 | 17.78,5.08 17.78,1.27
  pour Bottom (isolate 0.356): 62.87,5.08 58.42,5.08 58.42,8.26 8.89,8.26 7.62,9.53 7.62,14.61 59.69,14.61 59.69,26.04 58.42,27.3 44.45,27.3 43.18,28.57 17.78,28.57 16.51,29.84 8.89,29.84 8.89,33.66 24.13,33.66 24.13,32.38 24.77,31.75 28.57,31.75 29.21,32.38 29.21,33.02 38.73,33.02 39.37,33.66 59.69,33.66 59.69,41.27 55.88,45.09 50.8,45.09 49.53,43.81 46.35,43.81 43.81,46.35 10.16,46.35 10.16,48.9 11.43,48.9 13.97,51.44 55.88,51.44 55.88,55.88 62.87,55.88
  pour Top (isolate 0.356): 54.61,55.88 62.87,55.88 62.87,43.81 58.42,43.81 58.42,50.16 54.61,53.98
GND1  (via drill 2.54 pad 5.08)
  other vias: 3.81,52.7
  pour Top (isolate 0.356): 0.64,55.88 0.64,45.09 8.89,53.34 8.89,54.61 10.16,55.88
  pour Bottom (isolate 0.356): 0.64,55.88 0.64,46.35 10.16,55.88
N$1
  Top 2: 20,-1 -1,-1 -1,20
N$2
  Top 2: 43.48,-1 64.48,-1 64.48,20
N$3
  Top 2: 20,57.5 -1,57.5 -1,36.5
N$4
  Top 2: 64.48,36.5 64.48,57.5 43.48,57.5
N$5
  Bottom 2: 20,-1 -1,-1 -1,20
N$6
  Bottom 2: 43.48,-1 64.48,-1 64.48,20
N$7
  Bottom 2: 20,57.5 -1,57.5 -1,36.5
N$8
  Bottom 2: 64.48,36.5 64.48,57.5 43.48,57.5
N$9
  Top 0.406: Q2.1 58.42,8.2 58.42,12.06 | Q1.1 54.61,8.2 54.61,10.79 55.88,12.06 58.42,12.06 | 58.42,12.06 58.42,13.72 R1.1 57.78,13.97 55.52,16.23 Q3.2
N$10
  Top 0.406: Q7.1 41.91,8.2 41.91,10.79 43.18,12.06 45.72,12.06 | Q8.1 45.72,8.2 45.72,12.06 | 45.72,12.06 45.72,13.72 R3.1 45.09,13.97 42.82,16.23 Q9.2
N$11
  Top 0.406: Q5.1 55.88,28.52 55.88,32.38 | 55.88,32.38 56.52,32.38 | 56.52,32.38 59.05,32.38 59.69,31.75 59.69,28.52 Q4.1 | Q6.2 56.52,34.27 56.52,32.38 | R2.1 54.99,33.27 55.88,32.38
N$12
  Top 0.406: Q13.1 44.45,28.52 44.45,31.11 45.72,32.38 | 45.72,32.38 46.99,32.38 | 46.99,32.38 47.62,32.38 48.26,31.75 48.26,29.21 | Q11.1 48.26,28.52 48.26,29.21 | Q12.2 46.99,34.27 46.99,32.38 | R4.1 45.72,36.58 45.72,32.38 | Q10.1 51.44,27.89 51.44,24.13 50.8,23.5 48.9,23.5 48.26,24.13 48.26,29.21
N$13
  Top 0.406: Q17.1 33.02,28.52 33.02,31.75 31.75,33.02 | 31.75,33.02 36.83,33.02 | 36.83,33.02 38.1,33.02 38.73,32.38 40.01,32.38 40.64,31.75 40.64,28.52 Q15.1 | Q14.1 36.83,28.52 36.83,33.02 | R5.1 36.83,36.58 36.83,33.02 | Q16.2 31.39,33.38 31.75,33.02
N$14
  Top 0.406: Q18.1 29.21,8.2 29.21,10.79 30.48,12.06 33.02,12.06 | Q19.1 33.02,8.2 33.02,12.06 | 33.02,12.06 33.02,13.72 R6.1 32.38,13.97 30.12,16.23 Q20.2
N$15  (via drill 0.61 pad 1.02)
  Top 0.406: Q22.1 21.59,28.52 21.59,33.02 | 21.59,33.02 23.5,33.02 | 23.5,33.02 v25.4,33.02 25.4,28.52 Q24.1 | Q21.1 29.21,28.52 29.21,31.75 v27.94,33.02 | 23.5,33.02 R7.1 | 21.59,33.02 20.32,33.02 19.33,34.01 Q23.2
  Bottom 0.406: v25.4,33.02 v27.94,33.02
N$16
  Top 0.406: Q29.1 6.35,28.52 6.35,31.11 7.62,32.38 10.16,32.38 | 10.16,32.38 12.06,32.38 | 12.06,32.38 13.97,32.38 | 13.97,32.38 17.14,32.38 17.78,31.75 17.78,28.52 Q25.1 | Q26.1 13.97,28.52 13.97,32.38 | Q28.1 10.16,28.52 10.16,32.38 | 12.06,32.38 R8.1 | Q27.2 13.97,34.27 13.97,32.38
N$17  (via drill 0.61 pad 1.02)
  Top 0.406: 48.26,46.3 Q34.1 | 48.26,46.3 48.26,47.62 48.9,48.26 48.9,49.53 49.53,50.16 | 49.53,50.16 51.44,50.16 | 51.44,50.16 54.61,50.16 55.88,48.9 55.88,46.3 Q30.1 55.88,45.64 55.88,45.09 v54.61,43.81 | Q32.2 51.44,51.41 51.44,50.16 | Q33.1 48.9,41.86 48.9,44.45 48.26,45.09 48.26,46.3 | Q31.1 52.07,45.64 v52.07,43.81 | 49.53,50.16 R9.1
  Bottom 0.406: v54.61,43.81 v52.07,43.81
N$18
  Top 0.406: Q35.1 16.51,8.2 16.51,10.79 17.78,12.06 20.32,12.06 | Q36.1 20.32,8.2 20.32,12.06 | 20.32,12.06 20.32,13.72 R10.1 19.68,13.97 17.42,16.23 Q37.2
N$19
  Top 0.406: Q41.1 36.83,46.3 36.83,50.16 | 36.83,50.16 40.64,50.16 | Q39.1 40.64,46.3 40.64,50.16 | 40.64,50.16 42.55,50.16 | Q38.1 44.45,46.3 44.45,49.53 43.81,50.16 42.55,50.16 | Q40.2 42.55,51.41 42.55,50.16 | R11.1 36.83,52.45 36.83,50.16
N$20
  Top 0.406: 26.67,50.16 29.21,50.16 | Q42.1 33.02,46.3 33.02,49.53 32.38,50.16 | Q43.1 29.21,46.3 29.21,50.16 | 29.21,50.16 32.38,50.16 | Q45.1 25.4,46.3 25.4,46.35 | 25.4,46.35 25.4,47.62 26.67,48.9 26.67,50.16 | Q44.2 32.38,51.41 32.38,50.16 | R12.1 26.67,52.45 26.67,50.16 | Q46.1 20.95,45.67 20.95,44.45 21.59,43.81 24.13,43.81 25.4,45.09 25.4,46.35
N$21
  Top 0.406: 13.97,50.16 12.06,50.16 11.43,49.53 11.43,48.26 10.16,46.99 | Q47.1 17.78,46.3 17.78,49.53 17.14,50.16 16.51,50.16 | Q48.1 13.97,46.3 13.97,50.16 | Q50.1 10.16,46.3 10.16,46.99 | 13.97,50.16 16.51,50.16 | Q51.1 16.51,51.51 16.51,50.16 | Q49.2 13.97,51.33 13.97,50.16 | 10.16,46.99 10.16,44.45 9.27,43.56 R13.1
N$22
  Top 0.406: Q52.1 50.8,8.2 50.8,12.7 49.78,13.72 R14.1 50.16,14.35 50.16,16.48 Q53.2
N$24
  Top 0.406: Q54.1 38.1,8.2 38.1,12.7 37.08,13.72 R15.1 37.47,14.35 37.47,16.48 Q55.2
N$25
  Top 0.406: Q56.1 25.4,8.2 25.4,12.7 24.38,13.72 R16.1 24.77,14.35 24.77,16.48 Q57.2
N$26
  Top 0.406: Q58.1 12.7,8.2 12.7,12.7 11.68,13.72 R17.1 12.06,14.35 12.06,16.48 Q59.2
VCC  (via drill 0.61 pad 1.02)
  Top 0.406: 15.88,13.97 R17.2 | 15.88,13.97 R10.2 | 28.57,13.97 R16.2 | 28.57,13.97 R6.2 | 41.27,13.97 R15.2 | 41.27,13.97 R3.2 | 53.98,13.97 R14.2 | 53.98,13.97 R1.2 | Q59.3 13.56,19.05 v15.88,19.05 | Q37.3 18.14,19.05 v15.88,19.05 | Q57.3 26.26,19.05 v28.57,19.05 | Q20.3 30.84,19.05 v28.57,19.05 | Q55.3 38.96,19.05 v41.27,19.05 | Q9.3 43.54,19.05 v41.27,19.05 | Q53.3 51.66,19.05 v53.98,19.05 | Q3.3 56.24,19.05 v53.98,19.05 | v53.98,19.05 53.98,13.97 | v41.27,19.05 41.27,13.97 | v28.57,19.05 28.57,13.97 | v15.88,19.05 15.88,13.97 | 42.55,36.83 R4.2 v41.27,36.83 R5.2 | Q6.3 57.51,36.83 v56.52,36.83 56.26,36.58 R2.2 | Q16.3 32.77,36.58 v33.02,36.83 | Q27.3 15.21,36.83 v12.7,36.83 12.06,36.83 R8.2 | Q12.3 48.26,36.6 v48.26,37.47 | Q40.3 43.54,53.98 v41.91,53.98 40.64,52.7 R11.2 | R12.2 30.48,52.7 v31.75,53.98 33.38,53.98 Q44.3 | Q32.3 52.7,53.75 v52.7,54.61 | Q23.3 20.04,36.83 v19.68,36.83 | R13.2 5.08,43.18 v4.13,42.23
  Top 0.61: C2.1 46.99,54.61 v47.62,55.24 48.9,55.24 49.53,54.61 R9.2 | C3.1 23.75,37.85 v24.77,36.83 24.51,36.58 R7.2 | C4.1 40.26,35.81 v41.27,36.83 | C5.1 9.53,19.68 v10.16,19.05 | v2.54,1.91 1.27,3.17 1.27,20.95 v2.54,22.23 | v24.13,53.98 C1.1 | Q49.3 12.06,52.93 v12.06,53.34
  Top 1.27: 8.89,39.37 9.53,40.01 v10.16,40.01 10.79,40.64 v11.43,40.64 | 4.45,40.64 v4.13,40.64 v4.13,42.23 5.08,41.27
  Top 1.778: v2.54,1.91 v10.16,1.91 | 4.45,40.64 5.08,40.64 5.71,40.01 | 5.71,40.01 6.35,39.37 8.89,39.37 | 5.71,40.01 9.53,40.01
  Bottom 0.406: 48.26,36.83 v48.26,37.47
  Bottom 1.27: v53.98,19.05 v41.27,19.05 v28.57,19.05 v15.88,19.05 v10.16,19.05 2.54,19.05 | 2.54,1.27 v2.54,1.91 2.54,19.05 | 2.54,19.05 v2.54,22.23 2.54,40.64 | v56.52,36.83 48.26,36.83 v41.27,36.83 v33.02,36.83 v24.77,36.83 v19.68,36.83 v12.7,36.83 12.7,37.47 v10.16,40.01 10.79,40.64 v11.43,40.64 | 2.54,40.64 v4.13,40.64 | 47.62,53.98 v47.62,55.24 | 47.62,53.98 v41.91,53.98 v31.75,53.98 v24.13,53.98 12.06,53.98 | v52.7,54.61 52.7,53.98 47.62,53.98 | 12.06,53.98 v12.06,53.34 | 2.54,40.64 2.54,44.45 12.06,53.98 | 10.16,1.27 v10.16,1.91 10.16,5.08 12.7,5.08 | 15.24,1.27 15.24,5.08 12.7,5.08 | 12.7,5.08 12.7,1.27 | v4.13,42.23 4.13,40.96
  pour Bottom (isolate 0.356): 2.54,1.27 1.27,1.27 1.27,44.45 12.06,55.24 54.61,55.24 54.61,52.7 13.97,52.7 11.43,50.16 9.53,50.16 8.89,49.53 8.89,46.99 6.99,46.99 4.45,44.45 4.45,40.64 2.54,38.73 2.54,22.86 4.45,20.95 5.71,20.95 6.99,19.68 33.02,19.68 34.92,21.59 56.52,21.59 56.52,17.14 7.62,17.14 6.35,18.41 3.81,18.41 2.54,17.14
  pour Bottom (isolate 0.356): 9.53,38.1 9.53,40.01 10.79,41.27 13.34,41.27 15.24,39.37 15.24,36.83 32.38,36.83 34.29,38.73 48.26,38.73 49.53,37.47 56.52,37.47 56.52,34.92 38.73,34.92 38.1,34.29 28.57,34.29 26.67,36.2 24.77,36.2 23.5,34.92 12.7,34.92

### Text on the board
tNames: VCC | /G | /P | VCC | VCC | VCC | GND | /P3 | /G3 | /C3 | GND | /P2 | /G2 | /C2 | GND | /P1 | /G1 | /C1 | GND | /P0 | /G0 | /C0 | GND | GND